# EAGLE design MAX487_Devboard (EAGLE 9.6.2)
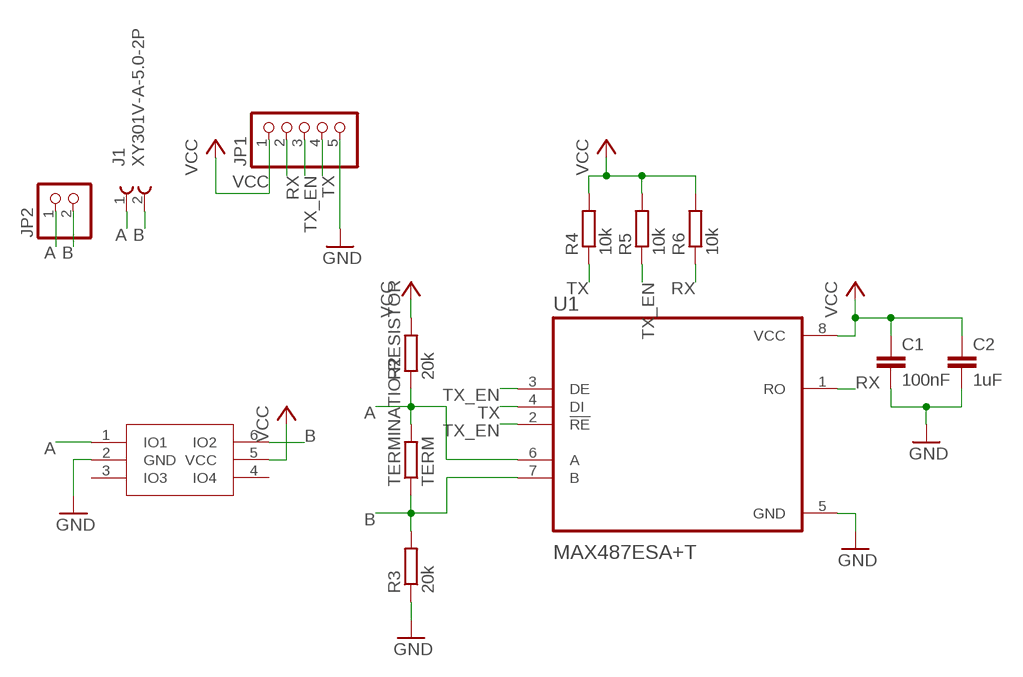
[diagram p0: schematic, sheet 1]

## Parts
C1  100nF  C-EUC0603  [C0603]
C2  1uF  C-EUC0603  [C0603]
J1  XY301V-A-5.0-2P  691102710002  [691102710002]
JP1  PINHD-1X5  [1X05]
JP2  PINHD-1X2  [1X02]
R2  20k  R-EU_R0402  [R0402]
R3  20k  R-EU_R0402  [R0402]
R4  10k  R-EU_R0402  [R0402]
R5  10k  R-EU_R0402  [R0402]
R6  10k  R-EU_R0402  [R0402]
TERMINATIO-RESISTOR  TERM  R-EU_R0805  [R0805]
U1  MAX487ESA+T  [SOIC127P600X175-8N]
U2  ESDU5V0H4  [SOT-23-6]

## Nets
A: J1.1 JP2.1 R2.1 TERMINATIO-RESISTOR.2 U1.6(A) U2.1(IO1)
B: J1.2 JP2.2 R3.2 TERMINATIO-RESISTOR.1 U1.7(B) U2.6(IO2)
GND: C1.2 C2.2 JP1.5 R3.1 U1.5(GND) U2.2(GND)
RX: JP1.2 R6.1 U1.1(RO)
TX: JP1.4 R4.1 U1.4(DI)
TX_EN: JP1.3 R5.1 U1.2(!RE) U1.3(DE)
VCC: C1.1 C2.1 JP1.1 R2.2 R4.2 R5.2 R6.2 U1.8(VCC) U2.5(VCC)
Unconnected: U2.3(IO3) U2.4(IO4)

## Library data of the parts
C1 C2 = rcl:C-EU: CAPACITOR, European symbol; SPICEPREFIX: C
J1 = 691102710002:691102710002: ConTBL SERIE 102 - 5.0MM HORIZONTAL ENTRY WITH PRESSURE CLAMP - 1.5MM² WIRES WR-TBL, 2 Pins=>Code : Con_TBL_Screw_PressureClamp_691102710002 <http://katalog.we-online.de/media/images/eican/Con_TBL_Screw_PressureClamp_6911027100xx_pf2.jpg> Details see: http://katalog.we-online.de/en/em/691_102_710_0xx Created 2014-06-17, Karrer Zheng 2014 (C) Würth Elektronik Check availability <https://pricing.snapeda.com/parts/691102710002/Wurth%20Elektronik/view-part?ref=eda>; AVAILABILITY: In Stock; DESCRIPTION: 2 Position Wire to Board Terminal Block Horizontal with Board 0.197 (5.00mm) Through Hole; MF: Wurth Elektronik; MP: 691102710002; PACKAGE: None; PRICE: None; PURCHASE-URL: https://pricing.snapeda.com/search/part/691102710002/?ref=eda
JP1 = pinhead:PINHD-1X5: PIN HEADER
JP2 = pinhead:PINHD-1X2: PIN HEADER
R2-R6 TERMINATIO-RESISTOR = rcl:R-EU_: RESISTOR, European symbol; SPICEPREFIX: R
U1 = MAX487ESA_T:MAX487ESA+T: None Check availability <https://pricing.snapeda.com/parts/MAX487ESA%2BT/Maxim%20Integrated/view-part?ref=eda>; AVAILABILITY: In Stock; DESCRIPTION: 1/1 Transceiver Half RS422, RS485 8-SOIC; MF: Maxim Integrated; MP: MAX487ESA+T; PACKAGE: SOIC-8 Maxim; PRICE: None; PURCHASE-URL: https://pricing.snapeda.com/search/part/MAX487ESA+T/?ref=eda
U2 = ESDU5V0H4:ESDU5V0H4

## Board
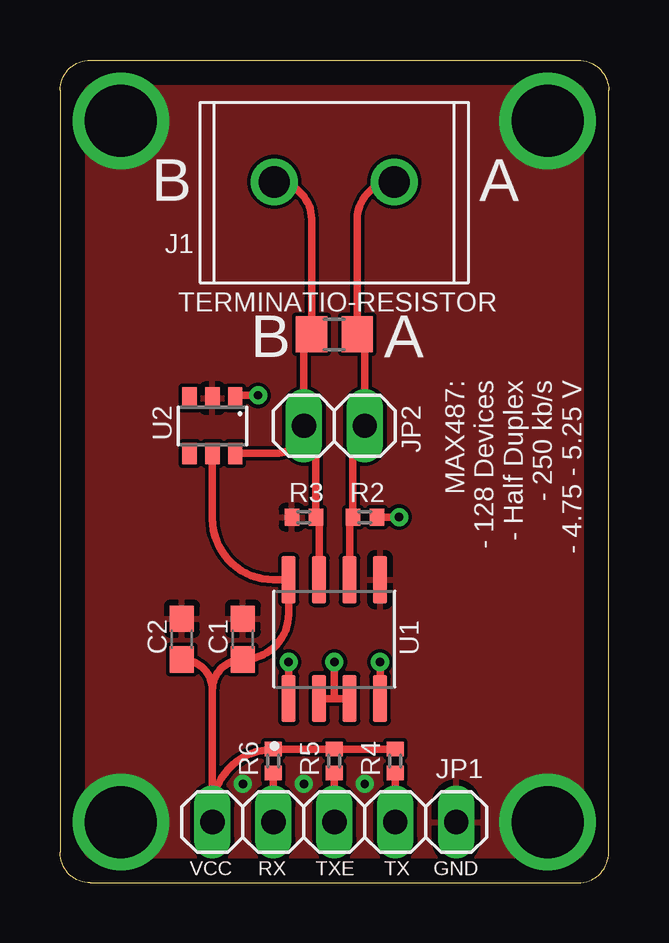
[diagram p1: board, top side]
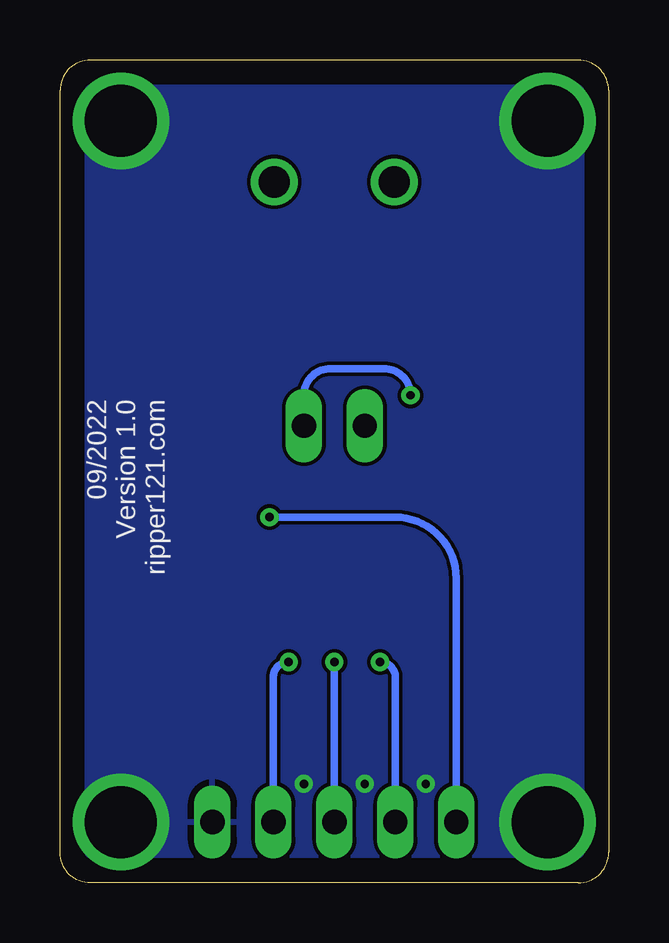
[diagram p2: board, bottom side, seen from below]

Size 22.86 x 34.29 mm. Coordinates in mm from the lower left corner, seen from the top.
Outline: 1.27,0 21.59,0 arc90 22.86,1.27 22.86,33.02 arc90 21.59,34.29 1.27,34.29 arc90 0,33.02 0,1.27 arc90 1.27,0
Copper layers (1*16): Top 0.035mm / dielectric 1.5mm / Bottom 0.035mm
Design rules "default": minimum track width 6mil, minimum drill 0.35mm, track to track 6mil, track to pad 6mil, pad to pad 6mil, via to via 6mil, smd to smd 6mil, copper to edge 40mil, drill to drill 6mil, minimum pad ring 10mil, minimum via ring 8mil, stop-mask expansion 4mil, vias tented up to drill 0mil, thermal gap 10mil

### Footprints (pad centres in the part's own frame; a part is rotated, then mirrored left to right if it is on the bottom)
C0603 = smd 1.1 x 1: 1 -0.85,0; 2 0.85,0
691102710002 = drill 1.3: 1 -2.5,0; 2 2.5,0
1X05 = drill 1.016 long: 1 -5.08,0; 2 -2.54,0; 3 0,0; 4 2.54,0; 5 5.08,0
1X02 = drill 1.016 long: 1 -1.27,0; 2 1.27,0
R0402 = smd 0.6 x 0.7: 1 -0.5,0; 2 0.5,0
R0805 = smd 1.3 x 1.5: 1 -0.95,0; 2 0.95,0
SOIC127P600X175-8N = smd 1.97 x 0.59: 1 -2.475,1.905; 2 -2.475,0.635; 3 -2.475,-0.635; 4 -2.475,-1.905; 5 2.475,-1.905; 6 2.475,-0.635; 7 2.475,0.635; 8 2.475,1.905
SOT-23-6 = smd 0.6 x 0.9: 1 -0.95,-1.15; 2 0,-1.15; 3 0.95,-1.15; 4 0.95,1.15; 5 0,1.15; 6 -0.95,1.15

### Placement (x,y rotation side)
C1  7.62,10.16 90 top
C2  5.08,10.16 90 top
J1  11.43,29.21 180 top
JP1  11.43,2.54 0 top
JP2  11.43,19.05 180 top
R2  12.7,15.24 0 top
R3  10.16,15.24 0 top
R4  13.97,5.08 90 top
R5  11.43,5.08 90 top
R6  8.89,5.08 90 top
TERMINATIO-RESISTOR  11.43,22.86 0 top
U1  11.43,10.16 90 top
U2  6.35,19.05 180 top

### Tracks (layer width: path | path; a pad name or v marks a point on that pad's centre or on a via)
A  (via drill 0.35)
  Top 0.305: U1.6 12.06,15.11 arc-90 R2.1 12.2,18.55 arc-90 JP2.1 12.7,22.54 arc90 TERMINATIO-RESISTOR.2 12.38,27.66 arc-90 J1.1 | U2.1 arc-90 7.42,20.32 v8.26,20.32
  Bottom 0.305: v8.26,20.32 arc-90 9.37,21.43 11.59,21.43 arc-90 12.7,20.32 JP2.1
B
  Top 0.305: U1.7 10.79,15.11 arc90 R3.2 10.66,18.55 arc90 JP2.2 | U2.6 9.01,17.9 arc90 JP2.2 | JP2.2 10.16,22.54 arc-90 TERMINATIO-RESISTOR.1 10.48,27.66 arc90 J1.2
GND  (via drill 0.35, 3)
  other vias: 2.54,31.75 20.32,31.75 2.54,2.54 20.32,2.54 10.16,4.13 7.62,4.13 12.7,4.13
  pour Top: 0,0 0,34.29 22.86,34.29 22.86,0
  pour Bottom: 0,0 0,34.29 22.86,34.29 22.86,0
RX  (via drill 0.35)
  Top 0.305: JP1.2 R6.1 | U1.1 v9.53,9.21
  Bottom 0.305: v9.53,9.21 arc90 8.89,8.57 JP1.2
TX  (via drill 0.35)
  Top 0.305: JP1.4 R4.1 | U1.4 v13.34,9.21
  Bottom 0.305: v13.34,9.21 arc-90 13.97,8.57 JP1.4
TX_EN  (via drill 0.35)
  Top 0.305: JP1.3 R5.1 | U1.2 11.43,7.68 | 11.43,7.68 U1.3 | 11.43,7.68 v11.43,9.21
  Bottom 0.305: v11.43,9.21 JP1.3
VCC  (via drill 0.35)
  Top 0.305: R4.2 R5.2 R6.2 arc-90 8.87,5.56 arc90 6.35,3.04 JP1.1 6.35,8.04 | 6.35,8.04 arc90 C2.1 | 6.35,8.04 arc-90 C1.1 arc90 9.53,11.21 U1.8 8.89,12.63 arc-90 6.35,15.18 U2.5 | R2.2 v14.13,15.24
  Bottom 0.305: v14.13,15.24 8.89,15.24 arc90 6.35,12.7 JP1.1

### Text on the board
tNames: B | A | B | A | MAX487: / - 128 Devices / - Half Duplex / - 250 kb/s / - 4.75 - 5.25 V | VCC | RX | TXE | TX | GND
bNames: 09/2022 / Version 1.0 / ripper121.com